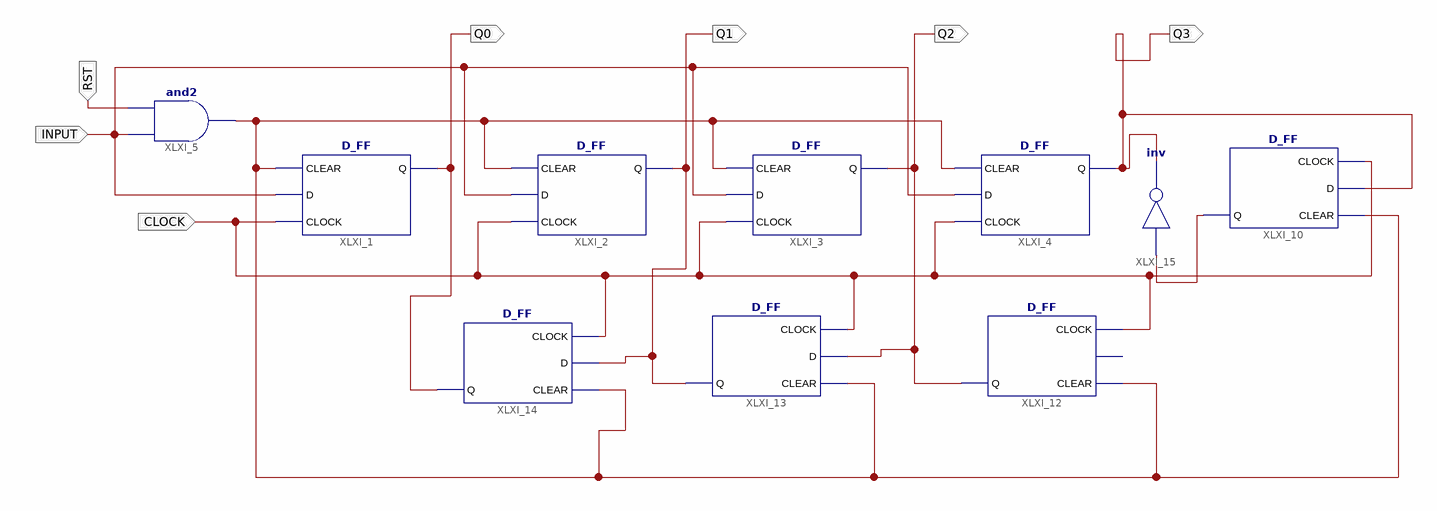
[diagram p0: schematic sheet 1]
// Xilinx ISE schematic LED_Pattern.sch (artix7) as structural Verilog: 10 symbols, 7 ports
module LED_Pattern (
  input  CLOCK,
  input  INPUT,
  input  RST,
  output Q0,
  output Q1,
  output Q2,
  output Q3
);

  wire XLXN_28, XLXN_31;

  D_FF XLXI_1 (.CLEAR(XLXN_28), .CLOCK(CLOCK), .D(INPUT), .Q(Q0));
  D_FF XLXI_2 (.CLEAR(XLXN_28), .CLOCK(CLOCK), .D(INPUT), .Q(Q1));
  D_FF XLXI_3 (.CLEAR(XLXN_28), .CLOCK(CLOCK), .D(INPUT), .Q(Q2));
  D_FF XLXI_4 (.CLEAR(XLXN_28), .CLOCK(CLOCK), .D(INPUT), .Q(Q3));
  and XLXI_5 (XLXN_28, INPUT, RST);
  D_FF XLXI_10 (.CLEAR(XLXN_28), .CLOCK(CLOCK), .D(Q3), .Q(XLXN_31));
  D_FF XLXI_12 (.CLEAR(XLXN_28), .CLOCK(CLOCK), .Q(Q2));  // open: D
  D_FF XLXI_13 (.CLEAR(XLXN_28), .CLOCK(CLOCK), .D(Q2), .Q(Q1));
  D_FF XLXI_14 (.CLEAR(XLXN_28), .CLOCK(CLOCK), .D(Q1), .Q(Q0));
  not XLXI_15 (Q3, XLXN_31);
endmodule
